# EAGLE design monBoard (EAGLE 5.12)

## Sheet 1 of 3
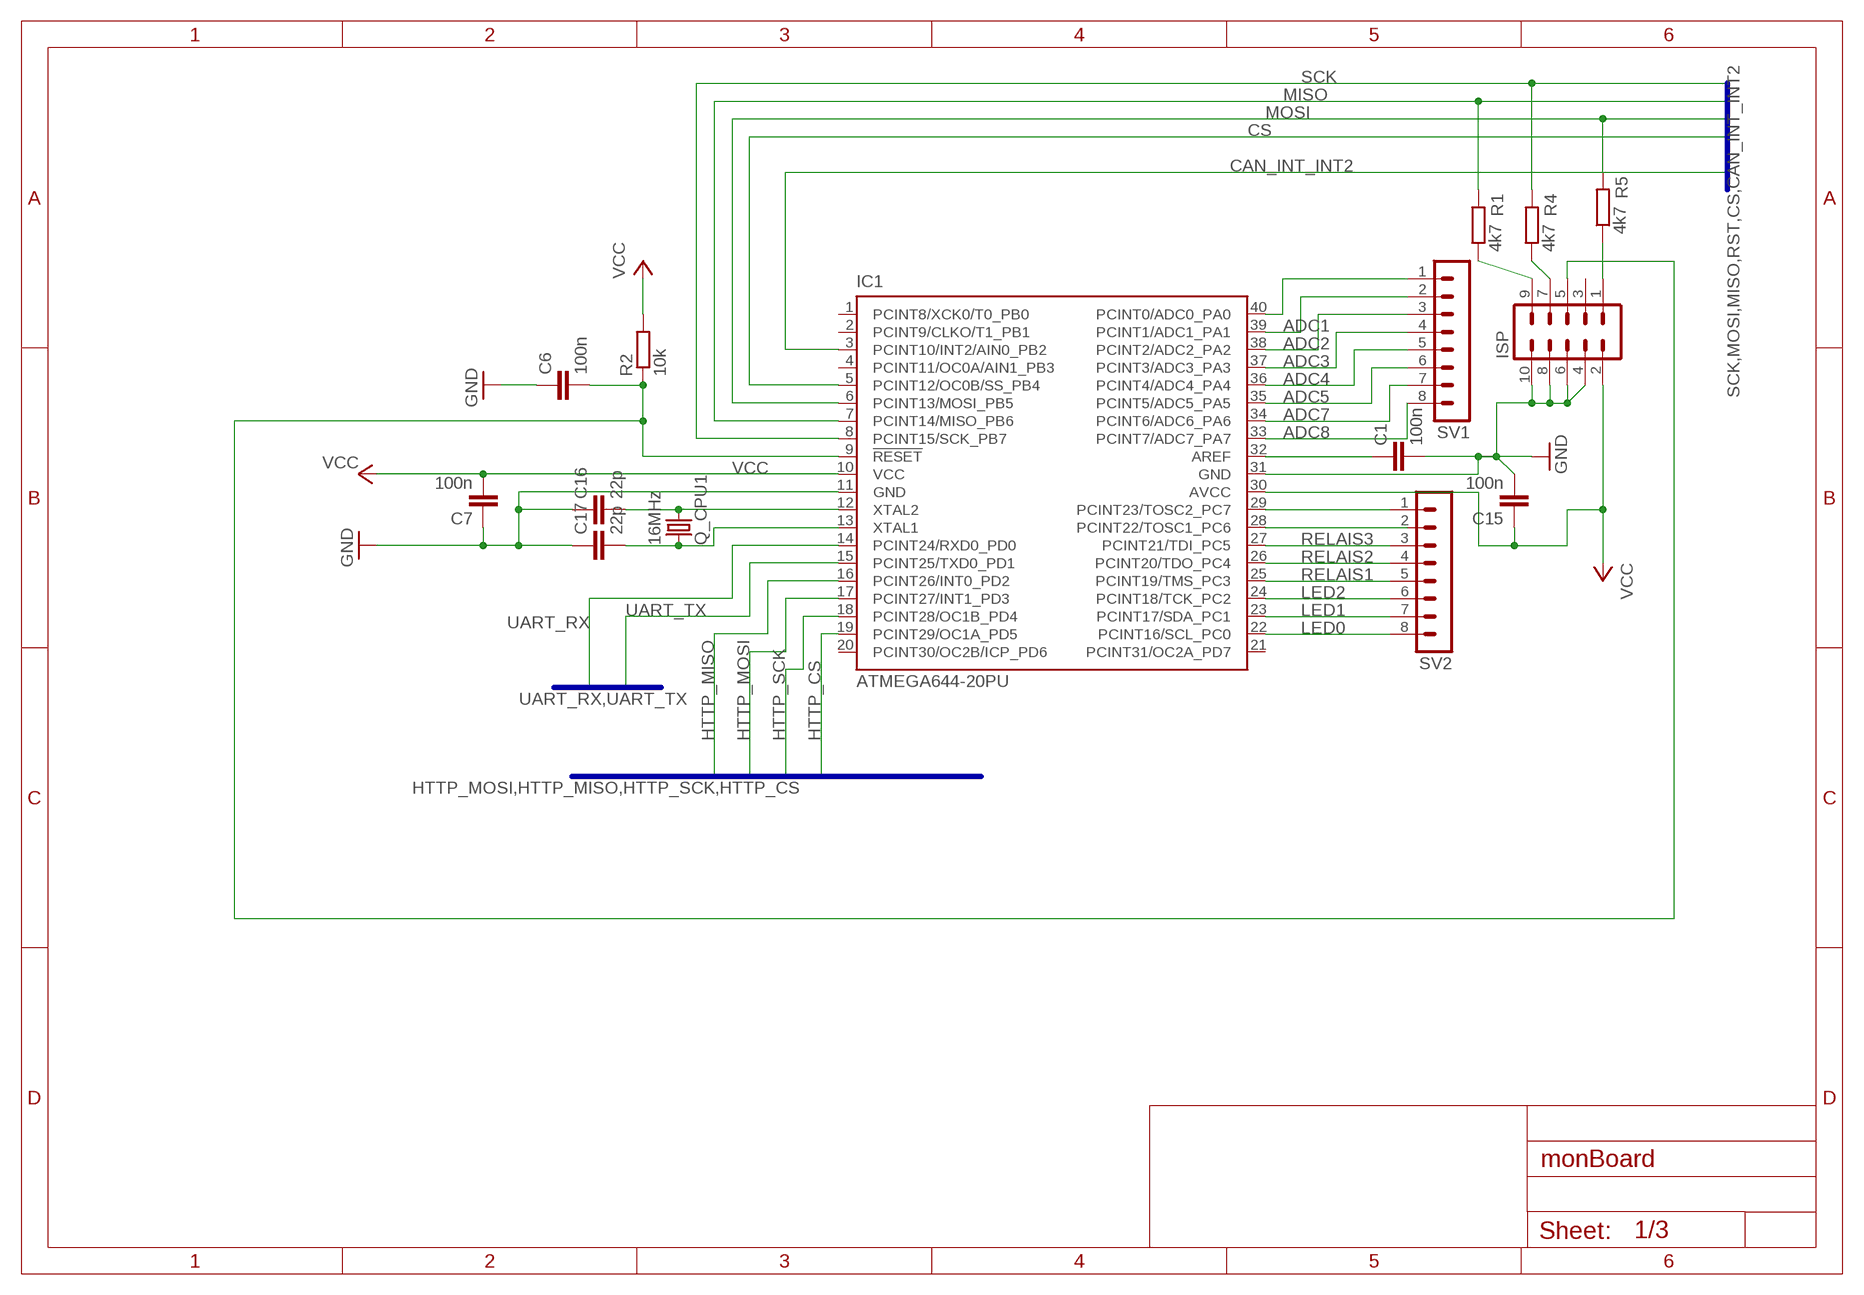
[diagram p0: schematic, sheet 1]

### Parts
C1  100n  C-EUC0603  [C0603]
C6  100n  C-EUC0603  [C0603]
C7  100n  C-EUC0603  [C0603]
C15  100n  C-EUC0603  [C0603]
C16  22p  C-EUC0603  [C0603]
C17  22p  C-EUC0603  [C0603]
IC1  ATMEGA644-20PU  [DIL40]
ISP  MA05-2  [MA05-2]
Q_CPU1  16MHz  CRYSTALHC49U-V  [HC49U-V]
R1  4k7  R-EU_R0805  [R0805]
R2  10k  R-EU_R0805  [R0805]
R4  4k7  R-EU_R0805  [R0805]
R5  4k7  R-EU_R0805  [R0805]
SV1  MA08-1  [MA08-1]
SV2  MA08-1  [MA08-1]

### Nets
ADC1: IC1.39(PCINT1/ADC1_PA1) SV1.2
ADC2: IC1.38(PCINT2/ADC2_PA2) SV1.3
ADC3: IC1.37(PCINT3/ADC3_PA3) SV1.4
ADC4: IC1.36(PCINT4/ADC4_PA4) SV1.5
ADC5: IC1.35(PCINT5/ADC5_PA5) SV1.6
ADC7: IC1.34(PCINT6/ADC6_PA6) SV1.7
ADC8: IC1.33(PCINT7/ADC7_PA7) SV1.8
CAN_INT_INT2: IC1.3(PCINT10/INT2/AIN0_PB2) ; also sheet 3
CS: IC1.5(PCINT12/OC0B/SS_PB4) ; also sheet 3
GND: C1.2 C6.1 C7.1 C15.2 C16.1 C17.1 IC1.11(GND) IC1.31(GND) ISP.4 ISP.6 ISP.8 ISP.10 ; also sheet 2,3
HTTP_CS: IC1.19(PCINT29/OC1A_PD5) ; also sheet 2
HTTP_MISO: IC1.16(PCINT26/INT0_PD2) ; also sheet 2
HTTP_MOSI: IC1.17(PCINT27/INT1_PD3) ; also sheet 2
HTTP_SCK: IC1.18(PCINT28/OC1B_PD4) ; also sheet 2
LED0: IC1.22(PCINT16/SCL_PC0) SV2.8
LED1: IC1.23(PCINT17/SDA_PC1) SV2.7
LED2: IC1.24(PCINT18/TCK_PC2) SV2.6
MISO: IC1.7(PCINT14/MISO_PB6) R1.2 ; also sheet 3
MOSI: IC1.6(PCINT13/MOSI_PB5) R5.2 ; also sheet 3
N$6: C16.2 IC1.12(XTAL2) Q_CPU1.1
N$7: C17.2 IC1.13(XTAL1) Q_CPU1.2
N$10: IC1.40(PCINT0/ADC0_PA0) SV1.1
N$14: IC1.28(PCINT22/TOSC1_PC6)
N$19: C1.1 IC1.32(AREF)
N$20: ISP.9 R1.1
N$25: ISP.1 R5.1
N$29: ISP.7 R4.1
N$33: C6.2 ISP.5 R2.1
N$34: IC1.29(PCINT23/TOSC2_PC7) SV2.1
RELAIS1: IC1.25(PCINT19/TMS_PC3) SV2.5
RELAIS2: IC1.26(PCINT20/TDO_PC4) SV2.4
RELAIS3: IC1.27(PCINT21/TDI_PC5) SV2.3
RESET: IC1.9(!RESET)
SCK: IC1.8(PCINT15/SCK_PB7) R4.2 ; also sheet 3
UART_RX: IC1.14(PCINT24/RXD0_PD0) ; also sheet 3
UART_TX: IC1.15(PCINT25/TXD0_PD1) ; also sheet 3
VCC: C7.2 C15.1 IC1.10(VCC) IC1.30(AVCC) ISP.2 R2.2 ; also sheet 3
Unconnected: IC1.1(PCINT8/XCK0/T0_PB0) IC1.2(PCINT9/CLKO/T1_PB1) IC1.4(PCINT11/OC0A/AIN1_PB3) IC1.20(PCINT30/OC2B/ICP_PD6) IC1.21(PCINT31/OC2A_PD7) ISP.3 SV2.2

### Buses
SCK,MOSI,MISO,RST,CS,CAN_INT_INT2
UART_RX,UART_TX
HTTP_MOSI,HTTP_MISO,HTTP_SCK,HTTP_CS

## Sheet 2 of 3
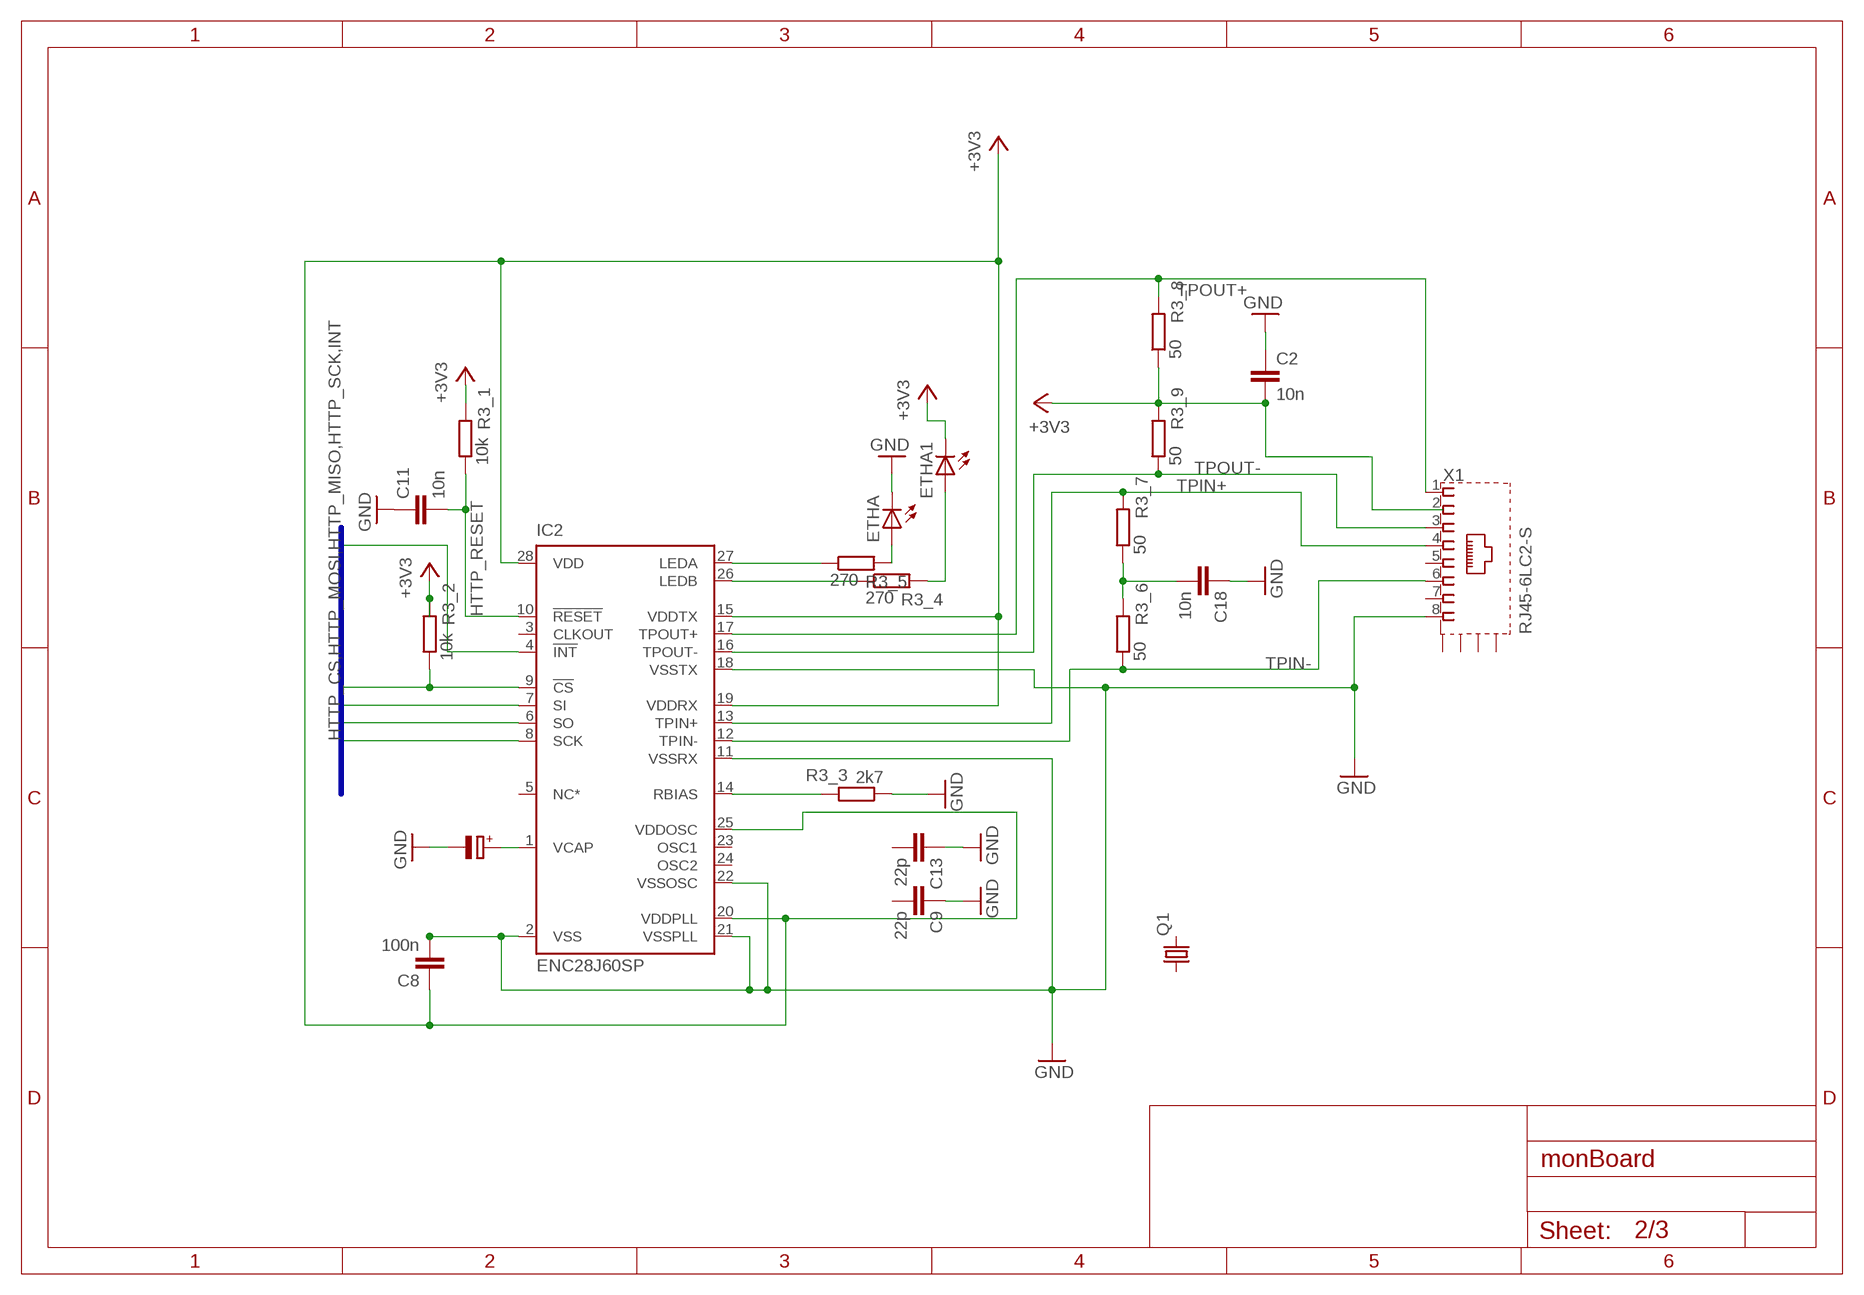
[diagram p1: schematic, sheet 2]

### Parts
C2  10n  C-EUC0603  [C0603]
C8  100n  C-EUC0603  [C0603]
C9  22p  C-EUC0603  [C0603]
C11  10n  C5/5  [C5B5]
C13  22p  C-EUC0603  [C0603]
C18  10n  C-EUC0603  [C0603]
ETHA  LEDCHIP-LED0805  [CHIP-LED0805]
ETHA1  LEDCHIP-LED0805  [CHIP-LED0805]
IC2  ENC28J60SP  [DIL28-3]
Q1  CRYSTALHC49U-V  [HC49U-V]
R3_1  10k  R-EU_R0805  [R0805]
R3_2  10k  R-EU_R0805  [R0805]
R3_3  2k7  R-EU_R0805  [R0805]
R3_4  270  R-EU_R0805  [R0805]
R3_5  270  R-EU_R0805  [R0805]
R3_6  50  R-EU_R0805  [R0805]
R3_7  50  R-EU_R0805  [R0805]
R3_8  50  R-EU_R0805  [R0805]
R3_9  50  R-EU_R0805  [R0805]
X1  RJ45-6LC2-S  [RJ45-SHIELD2]

### Nets
+3V3: C2.2 C8.1 ETHA1.C IC2.15(VDDTX) IC2.19(VDDRX) IC2.20(VDDPLL) IC2.25(VDDOSC) IC2.28(VDD) R3_1.2 R3_2.2 R3_8.1 R3_9.2 ; also sheet 3
GND: C2.1 C8.2 C9.1 C11.1 C13.1 C18.1 ETHA.C IC2.2(VSS) IC2.11(VSSRX) IC2.18(VSSTX) IC2.21(VSSPLL) IC2.22(VSSOSC) R3_3.1 X1.8 ; also sheet 1,3
HTTP_CS: IC2.9(!CS) R3_2.1 ; also sheet 1
HTTP_MISO: IC2.6(SO) ; also sheet 1
HTTP_MOSI: IC2.7(SI) ; also sheet 1
HTTP_RESET: C11.2 IC2.10(!RESET) R3_1.1
HTTP_SCK: IC2.8(SCK) ; also sheet 1
INT: IC2.4(!INT)
N$9: IC2.1(VCAP)
N$12: IC2.27(LEDA) R3_5.1
N$13: IC2.26(LEDB) R3_4.1
N$15: ETHA.A R3_5.2
N$16: ETHA1.A R3_4.2
N$24: C18.2 R3_6.2 R3_7.1
RBIAS: IC2.14(RBIAS) R3_3.2
TPIN+: IC2.13(TPIN+) R3_7.2 X1.4
TPIN-: IC2.12(TPIN-) R3_6.1 X1.6
TPOUT+: IC2.17(TPOUT+) R3_8.2 X1.1
TPOUT-: IC2.16(TPOUT-) R3_9.1 X1.3
Unconnected: C9.2 C13.2 IC2.3(CLKOUT) IC2.5(NC*) IC2.23(OSC1) IC2.24(OSC2) Q1.1 Q1.2 X1.2 X1.5 X1.7 X1.S1(S) X1.S2(S) X1.S3(S) X1.S4(S)

### Buses
HTTP_CS,HTTP_MOSI,HTTP_MISO,HTTP_SCK,INT

## Sheet 3 of 3
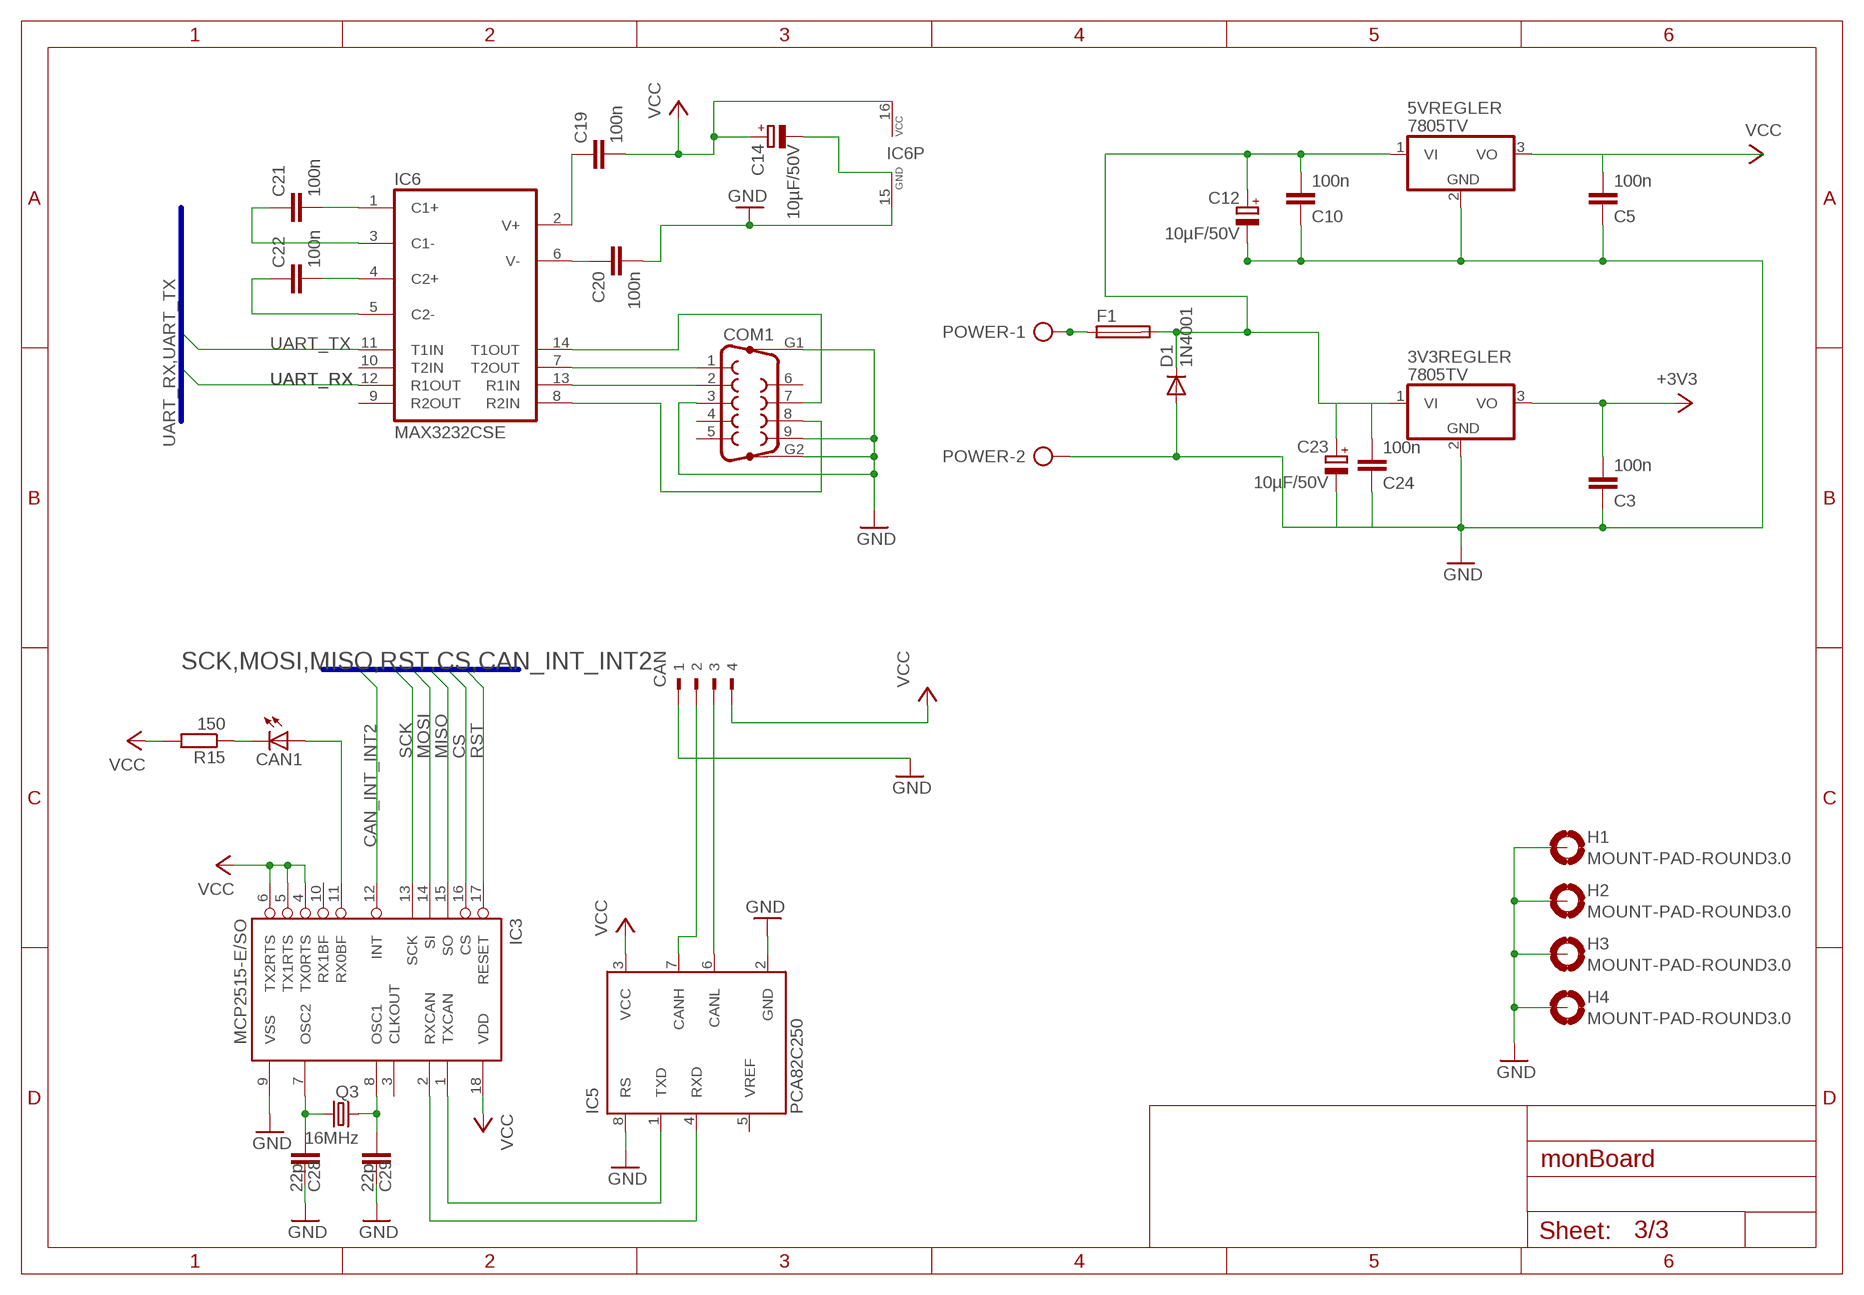
[diagram p2: schematic, sheet 3]

### Parts
3V3REGLER  7805TV  [TO220V]
5VREGLER  7805TV  [TO220V]
C3  100n  C-EUC0603  [C0603]
C5  100n  C-EUC0603  [C0603]
C10  100n  C-EUC0603  [C0603]
C12  10µF/50V  CPOL-EUE3.5-8  [E3,5-8]
C14  10µF/50V  CPOL-EUE3.5-8  [E3,5-8]
C19  100n  C-EUC0603  [C0603]
C20  100n  C-EUC0603  [C0603]
C21  100n  C-EUC0603  [C0603]
C22  100n  C-EUC0603  [C0603]
C23  10µF/50V  CPOL-EUE3.5-8  [E3,5-8]
C24  100n  C-EUC0603  [C0603]
C28  22p  C-EUC0603  [C0603]
C29  22p  C-EUC0603  [C0603]
CAN  90-4  [90-4]
CAN1  LEDCHIP-LED0805  [CHIP-LED0805]
COM1  F09HP  [F09HP]
D1  1N4001  1N4004  [DO41-10]
F1  SH22,5A  [SH22,5A]
H1  MOUNT-PAD-ROUND3.0  [3,0-PAD]
H2  MOUNT-PAD-ROUND3.0  [3,0-PAD]
H3  MOUNT-PAD-ROUND3.0  [3,0-PAD]
H4  MOUNT-PAD-ROUND3.0  [3,0-PAD]
IC3  MCP2515-E/SO  [SO18L]
IC5  PCA82C250  [DIL08]
IC6  MAX3232CSE  [SO16]
POWER  AK500/2-H  [AK500/2-H]
Q3  16MHz  CRYSTALHC49U-V  [HC49U-V]
R15  150  R-EU_R0805  [R0805]

### Nets
+3V3: 3V3REGLER.3(VO) C3.2 ; also sheet 2
CAN_INT_INT2: IC3.12(INT) ; also sheet 1
CS: IC3.16(CS) ; also sheet 1
GND: 3V3REGLER.2(GND) 5VREGLER.2(GND) C3.1 C5.1 C10.1 C12.- C20.2 C23.- C24.1 C28.2 C29.2 CAN.1 COM1.3 COM1.9 COM1.G1 COM1.G2 D1.A H1.B3,0(MOUNT) H2.B3,0(MOUNT) H3.B3,0(MOUNT) H4.B3,0(MOUNT) IC3.9(VSS) IC5.2(GND) IC5.8(RS) IC6.15(GND) POWER.2 ; also sheet 1,2
MISO: IC3.15(SO) ; also sheet 1
MOSI: IC3.14(SI) ; also sheet 1
N$1: C21.2 IC6.1(C1+)
N$3: IC3.1(TXCAN) IC5.1(TXD)
N$4: IC3.2(RXCAN) IC5.4(RXD)
N$5: CAN1.A IC3.11(RX0BF)
N$11: CAN.3 IC5.6(CANL)
N$30: C22.2 IC6.4(C2+)
N$32: C14.-
N$36: C22.1 IC6.5(C2-)
N$37: C21.1 IC6.3(C1-)
N$38 [Power]: F1.1 POWER.1
N$40: COM1.7 IC6.14(T1OUT)
N$41: COM1.8 IC6.8(R2IN)
N$42: 5VREGLER.3(VO) C5.2
N$43: C19.1 IC6.2(V+)
N$46: C20.1 IC6.6(V-)
N$48: CAN1.C R15.1
N$49: COM1.1 IC6.7(T2OUT)
N$50: COM1.2 IC6.13(R1IN)
N$53: C28.1 IC3.7(OSC2) Q3.1
N$54: C29.1 IC3.8(OSC1) Q3.2
N$56 [Power]: 3V3REGLER.1(VI) 5VREGLER.1(VI) C10.2 C12.+ C23.+ C24.2 D1.C F1.2
N$59: CAN.2 IC5.7(CANH)
RST: IC3.17(RESET)
SCK: IC3.13(SCK) ; also sheet 1
UART_RX: IC6.12(R1OUT) ; also sheet 1
UART_TX: IC6.11(T1IN) ; also sheet 1
VCC: C14.+ C19.2 CAN.4 IC3.4(TX0RTS) IC3.5(TX1RTS) IC3.6(TX2RTS) IC3.18(VDD) IC5.3(VCC) IC6.16(VCC) R15.2 ; also sheet 1
Unconnected: COM1.4 COM1.5 COM1.6 IC3.3(CLKOUT) IC3.10(RX1BF) IC5.5(VREF) IC6.9(R2OUT) IC6.10(T2IN)

### Buses
UART_RX,UART_TX
SCK,MOSI,MISO,RST,CS,CAN_INT_INT2

## Library data of the parts
3V3REGLER 5VREGLER = linear:78*: Positive VOLTAGE REGULATOR Source: http://cache.national.com/ds/LM/LM78L05.pdf http://www.fairchildsemi.com/ds/LM/LM7805.pdf
C1-C3 C5-C10 C13 C15-C22 C24 C28 C29 = rcl:C-EU: CAPACITOR, European symbol
C11 = capacitor-wima:C: CAPACITOR naming: grid - package width
C12 C14 C23 = rcl:CPOL-EU: POLARIZED CAPACITOR, European symbol
CAN = con-weidmueller-sl35:90-4: WEIDMUELLER CLAMP CONNECTOR; OC_FARNELL: unknown; OC_NEWARK: unknown
CAN1 ETHA ETHA1 = led:LED: LED OSRAM: - CHIPLED LG R971, LG N971, LY N971, LG Q971, LY Q971, LO R971, LY R971 LH N974, LH R974 LS Q976, LO Q976, LY Q976 LO Q996 - Hyper CHIPLED LW Q18S LB Q993, LB Q99A, LB R99A - SideLED LS A670, LO A670, LY A670, LG A670, LP A670 LB A673, LV A673, LT A673, LW A673 LH A674 LY A675 LS A676, LA A676, LO A676, LY A676, LW A676 LS A679, LY A679, LG A679 - Hyper Micro SIDELED® LS Y876, LA Y876, LO Y876, LY Y876 LT Y87S - SmartLED LW L88C, LW L88S LB L89C, LB L89S, LG L890 LS L89K, LO L89K, LY L89K LS L896, LA L896, LO L896, LY L896 - TOPLED LS T670, LO T670, LY T670, LG T670, LP T670 LSG T670, LSP T670, LSY T670, LOP T670, LYG T670 LG T671, LOG T671, LSG T671 LB T673, LV T673, LT T673, LW T673 LH T674 LS T676, LA T676, LO T676, LY T676, LB T676, LH T676, LSB T676, LW T676 LB T67C, LV T67C, LT T67C, LS T67K, LO T67K, LY T67K, LW E67C LS E67B, LA E67B, LO E67B, LY E67B, LB E67C, LV E67C, LT E67C LW T67C LS T679, LY T679, LG T679 LS T770, LO T770, LY T770, LG T770, LP T770 LB T773, LV T773, LT T773, LW T773 LH T774 LS E675, LA E675, LY E675, LS T675 LS T776, LA T776, LO T776, LY T776, LB T776 LHGB T686 LT T68C, LB T68C - Hyper Mini TOPLED® LB M676 - Mini TOPLED Santana® LG M470 LS M47K, LO M47K, LY M47K Source: http://www.osram.convergy.de LUXEON: - LUMILED® LXK2-PW12-R00, LXK2-PW12-S00, LXK2-PW14-U00, LXK2-PW14-V00 LXK2-PM12-R00, LXK2-PM12-S00, LXK2-PM14-U00 LXK2-PE12-Q00, LXK2-PE12-R00, LXK2-PE12-S00, LXK2-PE14-T00, LXK2-PE14-U00 LXK2-PB12-K00, LXK2-PB12-L00, LXK2-PB12-M00, LXK2-PB14-N00, LXK2-PB14-P00, LXK2-PB14-Q00 LXK2-PR12-L00, LXK2-PR12-M00, LXK2-PR14-Q00, LXK2-PR14-R00 LXK2-PD12-Q00, LXK2-PD12-R00, LXK2-PD12-S00 LXK2-PH12-R00, LXK2-PH12-S00 LXK2-PL12-P00, LXK2-PL12-Q00, LXK2-PL12-R00 Source: www.luxeon.com KINGBRIGHT: KA-3528ASYC Source: www.kingbright.com
COM1 = con-subd:F09HP: SUB-D; OC_FARNELL: unknown; OC_NEWARK: unknown
D1 = diode:1N4004: DIODE general purpose rectifier, 1 A
F1 = fuse:SH22,5A: FUSE HOLDER grid 22,5mm, isolated cap OGN0031 8201, Schurter (Buerklin)
H1-H4 = holes:MOUNT-PAD-ROUND: MOUNTING PAD, round
IC1 = atmel:ATMEGA644-*PU: 8-bit Microcontroller with 64K Bytes In-System Programmable Flash Auto generated by make-symbol-device-package-bsdl.ulp Rev. 34 Source: http://www.atmel.com/dyn/resources/prod_documents/doc2593.pdf; MPN: ATMEGA644-20PU; OC_FARNELL: 1288340; OC_NEWARK: 23M5060
IC2 = microchip:ENC28J60: Stand-Alone Ethernet Controller with SPI Interface Source: http://ww1.microchip.com/downloads/en/DeviceDoc/39662c.pdf; MF: MICROCHIP; MPN: ENC28J60/SP; OC_FARNELL: 1084619; OC_NEWARK: 96K3661
IC3 = mcp2515:MCP2515
IC5 = micro-philips:PCA82C250: CAN CONTROLLER INTERFACE; OC_FARNELL: 3692358; OC_NEWARK: unknown
IC6 = maxim:MAX3232*: True RS-232 Transceivers 3.0V to 5.5V, Low-Power up to 1Mbps, Using Four 0.1µF External Capacitors Source: http://pdfserv.maxim-ic.com/en/ds/MAX3222-MAX3241.pdf; MPN: MAX3232CSE; OC_FARNELL: 9725490; OC_NEWARK: 90C2890
ISP = con-lstb:MA05-2: PIN HEADER; OC_FARNELL: unknown; OC_NEWARK: unknown
POWER = con-ptr500:AK500/2-H: CONNECTOR Aug. 2004 / PTR Meßtechnik: Die Bezeichnung der Serie AK505 wurde geändert. Es handelt sich hierbei um AK500 in horizontaler Ausführung.
Q1 Q3 Q_CPU1 = crystal:CRYSTAL: CRYSTAL; OC_FARNELL: 1666969; OC_NEWARK: unknown
R1 R2 R3_1-R3_9 R4 R5 R15 = rcl:R-EU_: RESISTOR, European symbol
SV1 SV2 = con-lstb:MA08-1: PIN HEADER; OC_FARNELL: unknown; OC_NEWARK: unknown
X1 = con-tycoelectronics:RJ45*2: RJ45 Low Profile Shield Type 2 For all RJ45 L, LC, LCT and X Series Models Source: www.tycoelectronics.com .. ENG_DS_1654001_1099_RJ_L_0507.pdf; MPN: RJ45-6LC2-S; OC_FARNELL: unknown; OC_NEWARK: 16R6095

## Net classes
1 Power: width 0.406 mm

## Board
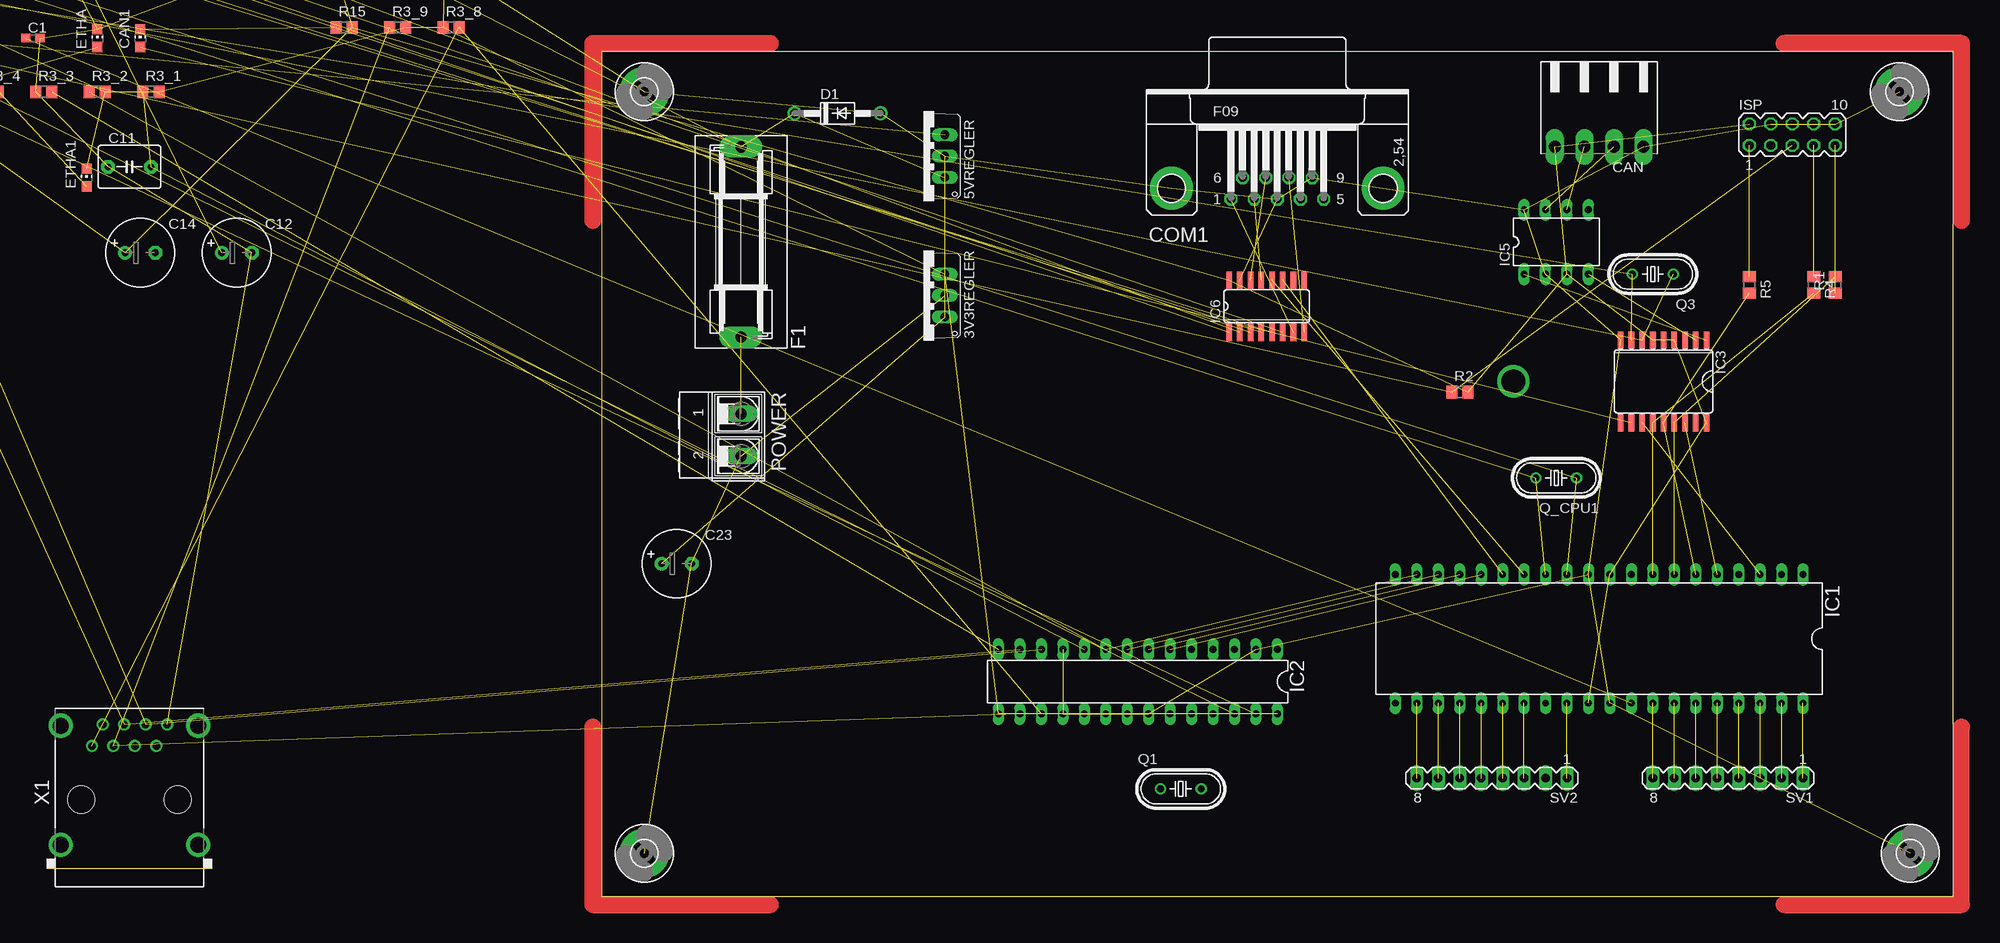
[diagram p3: board, top side]
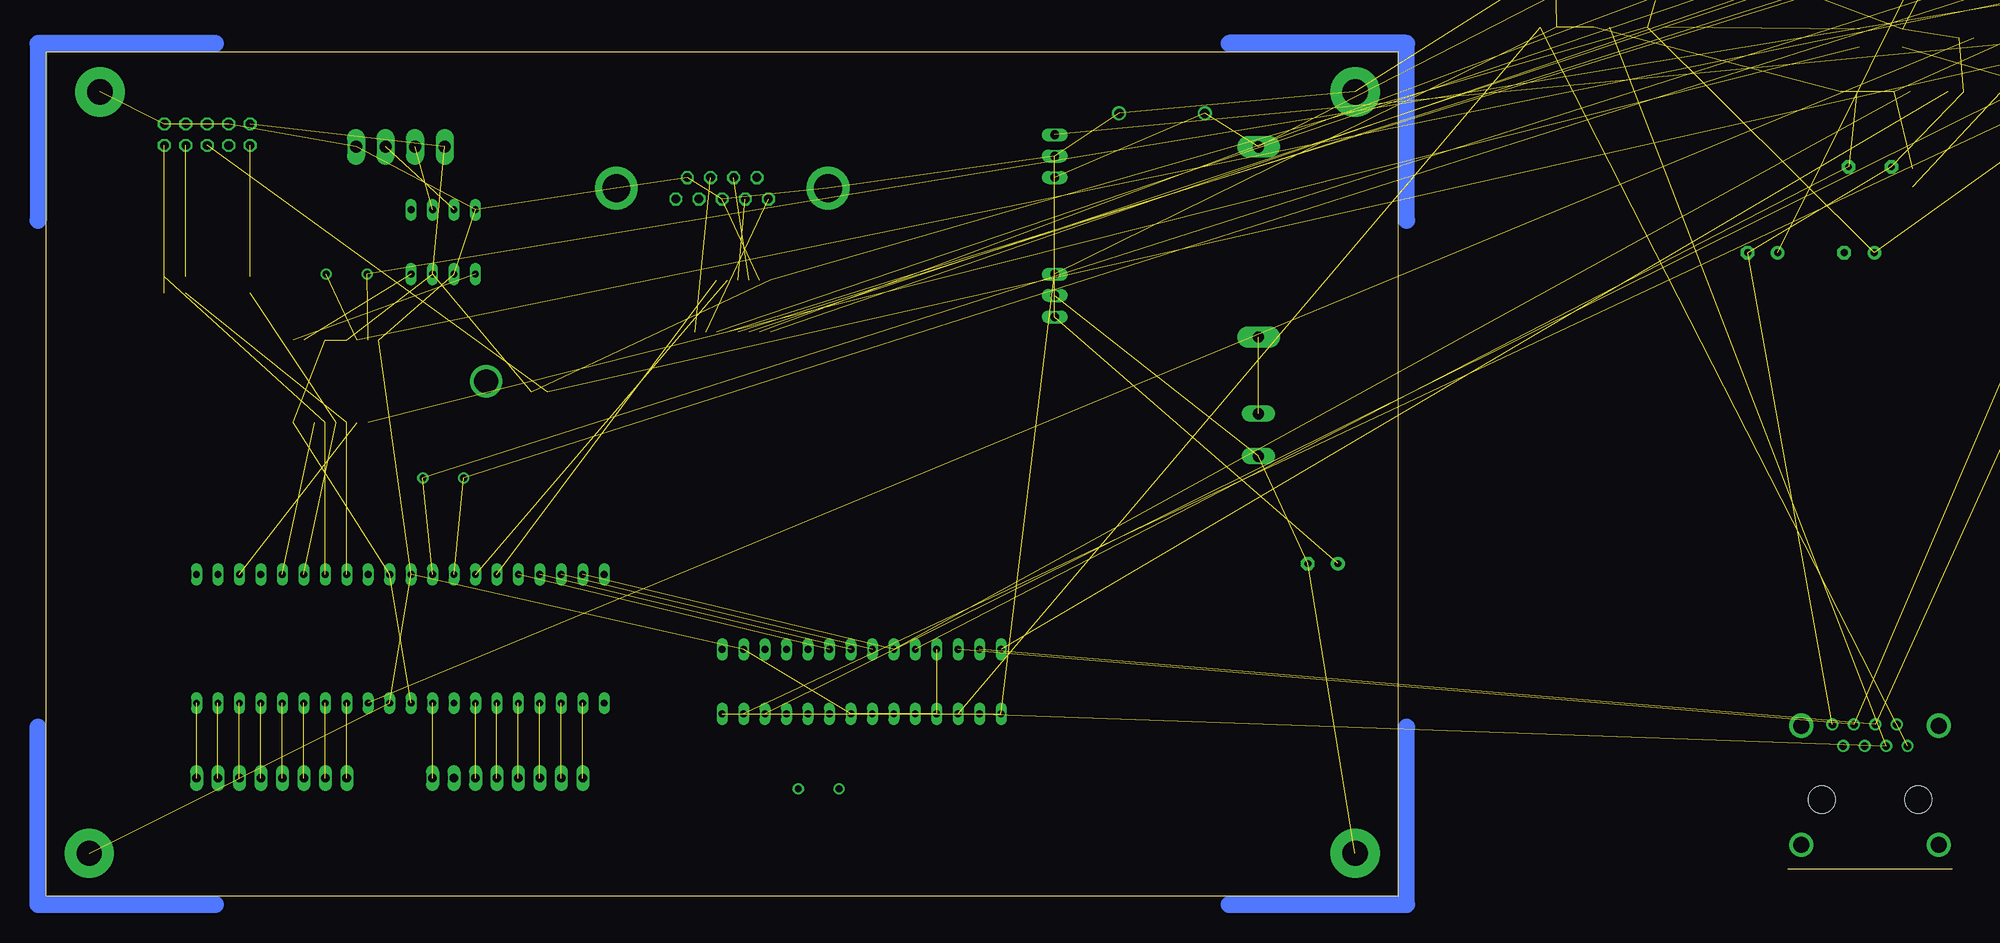
[diagram p4: board, bottom side, seen from below]

Size 160 x 100 mm. Coordinates in mm from the lower left corner, seen from the top.
Outline: 0,0 160,0 160,100 0,100 0,0
Copper layers (1*16): Top 0.035mm / dielectric 1.5mm / Bottom 0.035mm
Design rules "default": minimum track width 10mil, minimum drill 24mil, track to track 8mil, track to pad 8mil, pad to pad 8mil, via to via 8mil, smd to smd 8mil, copper to edge 40mil, drill to drill 8mil, minimum pad ring 10mil, minimum via ring 8mil, stop-mask expansion 4mil, vias tented up to drill 0mil, thermal gap 10mil

### Footprints (pad centres in the part's own frame; a part is rotated, then mirrored left to right if it is on the bottom)
TO220V = drill 1.016 long: 1 -2.54,-2.54; 2 0,-2.54; 3 2.54,-2.54
C0603 = smd 1.1 x 1: 1 -0.85,0; 2 0.85,0
C5B5 = drill 0.813 pad 1.6 octagon: 1 -2.54,0; 2 2.54,0
E3,5-8 = drill 0.813 pad 1.6 round: + -1.778,0 | drill 0.813 pad 1.6 octagon: - 1.778,0
90-4 = drill 1.422 long: 1 -5.25,5.25; 2 -1.75,5.25; 3 1.75,5.25; 4 5.25,5.25
CHIP-LED0805 = smd 1.2 x 1.2: A 0,-1.05; C 0,1.05
F09HP = drill 1.016 octagon: 1 -5.486,-1.27; 2 -2.743,-1.27; 3 0,-1.27; 4 2.743,-1.27; 5 5.486,-1.27; 6 -4.115,1.27; 7 -1.372,1.27; 8 1.372,1.27; 9 4.115,1.27 | drill 3.302 pad 5.08 round: G1 -12.522,0; G2 12.522,0
DO41-10 = drill 1.118 round: A 5.08,0; C -5.08,0
SH22,5A = drill 1.321 pad 2.54 long: 1 -11.252,0; 2 11.252,0
3,0-PAD = drill 3 pad 5.842 round: B3,0 0,0
DIL40 = drill 0.813 long: 1 -24.13,-7.62; 2 -21.59,-7.62; 3 -19.05,-7.62; 4 -16.51,-7.62; 5 -13.97,-7.62; 6 -11.43,-7.62; 7 -8.89,-7.62; 8 -6.35,-7.62; 9 -3.81,-7.62; 10 -1.27,-7.62; 11 1.27,-7.62; 12 3.81,-7.62; 13 6.35,-7.62; 14 8.89,-7.62; 15 11.43,-7.62; 16 13.97,-7.62; 17 16.51,-7.62; 18 19.05,-7.62; 19 21.59,-7.62; 20 24.13,-7.62; 21 24.13,7.62; 22 21.59,7.62; 23 19.05,7.62; 24 16.51,7.62; 25 13.97,7.62; 26 11.43,7.62; 27 8.89,7.62; 28 6.35,7.62; 29 3.81,7.62; 30 1.27,7.62; 31 -1.27,7.62; 32 -3.81,7.62; 33 -6.35,7.62; 34 -8.89,7.62; 35 -11.43,7.62; 36 -13.97,7.62; 37 -16.51,7.62; 38 -19.05,7.62; 39 -21.59,7.62; 40 -24.13,7.62
DIL28-3 = drill 0.813 long: 1 -16.51,-3.81; 2 -13.97,-3.81; 3 -11.43,-3.81; 4 -8.89,-3.81; 5 -6.35,-3.81; 6 -3.81,-3.81; 7 -1.27,-3.81; 8 1.27,-3.81; 9 3.81,-3.81; 10 6.35,-3.81; 11 8.89,-3.81; 12 11.43,-3.81; 13 13.97,-3.81; 14 16.51,-3.81; 15 16.51,3.81; 16 13.97,3.81; 17 11.43,3.81; 18 8.89,3.81; 19 6.35,3.81; 20 3.81,3.81; 21 1.27,3.81; 22 -1.27,3.81; 23 -3.81,3.81; 24 -6.35,3.81; 25 -8.89,3.81; 26 -11.43,3.81; 27 -13.97,3.81; 28 -16.51,3.81
SO18L = smd 0.66 x 2.032: 1 -5.08,-4.902; 2 -3.81,-4.902; 3 -2.54,-4.902; 4 -1.27,-4.902; 5 0,-4.902; 6 1.27,-4.902; 7 2.54,-4.902; 8 3.81,-4.902; 9 5.08,-4.902; 10 5.08,4.902; 11 3.81,4.902; 12 2.54,4.902; 13 1.27,4.902; 14 0,4.902; 15 -1.27,4.902; 16 -2.54,4.902; 17 -3.81,4.902; 18 -5.08,4.902
DIL08 = drill 0.813 long: 1 -3.81,-3.81; 2 -1.27,-3.81; 3 1.27,-3.81; 4 3.81,-3.81; 5 3.81,3.81; 6 1.27,3.81; 7 -1.27,3.81; 8 -3.81,3.81
SO16 = smd 0.66 x 2.032: 1 -4.445,-3.073; 2 -3.175,-3.073; 3 -1.905,-3.073; 4 -0.635,-3.073; 5 0.635,-3.073; 6 1.905,-3.073; 7 3.175,-3.073; 8 4.445,-3.073; 9 4.445,3.073; 10 3.175,3.073; 11 1.905,3.073; 12 0.635,3.073; 13 -0.635,3.073; 14 -1.905,3.073; 15 -3.175,3.073; 16 -4.445,3.073
MA05-2 = drill 1.016 octagon: 1 -5.08,-1.27; 2 -5.08,1.27; 3 -2.54,-1.27; 4 -2.54,1.27; 5 0,-1.27; 6 0,1.27; 7 2.54,-1.27; 8 2.54,1.27; 9 5.08,-1.27; 10 5.08,1.27
AK500/2-H = drill 1.321 long: 1 -2.515,0; 2 2.515,0
HC49U-V = drill 0.813 round: 1 -2.413,0; 2 2.413,0
R0805 = smd 1.3 x 1.5: 1 -0.95,0; 2 0.95,0
MA08-1 = drill 1.016 long: 1 -8.89,0; 2 -6.35,0; 3 -3.81,0; 4 -1.27,0; 5 1.27,0; 6 3.81,0; 7 6.35,0; 8 8.89,0
RJ45-SHIELD2 = drill 0.9 pad 1.4 round: 1 -4.445,6.35; 2 -3.175,8.89; 3 -1.905,6.35; 4 -0.635,8.89; 5 0.635,6.35; 6 1.905,8.89; 7 3.175,6.35; 8 4.445,8.89 | drill 1.9 pad 2.5 round: S1 -8.128,-5.33; S2 8.128,-5.33; S3 -8.128,8.76; S4 8.128,8.76 | hole 3.251: -5.715,0; 5.715,0

### Placement (x,y rotation side)
3V3REGLER  38.1,71.12 90 top
5VREGLER  38.1,87.63 90 top
C1  -67.31,101.6 0 top  (outside the outline)
C2  -16.51,114.3 0 top  (outside the outline)
C3  -73.66,101.6 0 top  (outside the outline)
C5  -80.01,101.6 0 top  (outside the outline)
C6  -86.36,101.6 0 top  (outside the outline)
C7  -92.71,101.6 0 top  (outside the outline)
C8  -17.78,109.22 0 top  (outside the outline)
C9  -21.59,114.3 0 top  (outside the outline)
C10  -24.13,109.22 0 top  (outside the outline)
C11  -55.88,86.36 0 top  (outside the outline)
C12  -43.18,76.2 0 top  (outside the outline)
C13  -67.31,109.22 0 top  (outside the outline)
C14  -54.61,76.2 0 top  (outside the outline)
C15  -30.48,109.22 0 top  (outside the outline)
C16  -72.39,109.22 0 top  (outside the outline)
C17  -77.47,109.22 0 top  (outside the outline)
C18  -82.55,109.22 0 top  (outside the outline)
C19  -36.83,109.22 0 top  (outside the outline)
C20  -43.18,109.22 0 top  (outside the outline)
C21  -49.53,109.22 0 top  (outside the outline)
C22  -55.88,109.22 0 top  (outside the outline)
C23  8.89,39.37 0 top
C24  -62.23,109.22 0 top  (outside the outline)
C28  -87.63,109.22 0 top  (outside the outline)
C29  -92.71,109.22 0 top  (outside the outline)
CAN  118.11,93.98 180 top
CAN1  -54.61,101.6 0 top  (outside the outline)
COM1  80.01,83.82 0 top
D1  27.94,92.71 0 top
ETHA  -59.69,101.6 0 top  (outside the outline)
ETHA1  -60.96,85.09 0 top  (outside the outline)
F1  16.51,77.47 90 top
H1  154.94,5.08 0 top
H2  5.08,95.25 0 top
H3  5.08,5.08 0 top
H4  153.67,95.25 0 top
IC1  118.11,30.48 180 top
IC2  63.5,25.4 180 top
IC3  125.73,60.96 180 top
IC5  113.03,77.47 0 top
IC6  78.74,69.85 0 top
ISP  140.97,90.17 0 top
POWER  16.51,54.61 270 top
Q1  68.58,12.7 0 top
Q3  124.46,73.66 180 top
Q_CPU1  113.03,49.53 180 top
R1  146.05,72.39 90 top
R2  101.6,59.69 0 top
R3_1  -53.34,95.25 0 top  (outside the outline)
R3_2  -59.69,95.25 0 top  (outside the outline)
R3_3  -66.04,95.25 0 top  (outside the outline)
R3_4  -72.39,95.25 0 top  (outside the outline)
R3_5  -78.74,95.25 0 top  (outside the outline)
R3_6  -85.09,95.25 0 top  (outside the outline)
R3_7  -91.44,95.25 0 top  (outside the outline)
R3_8  -17.78,102.87 0 top  (outside the outline)
R3_9  -24.13,102.87 0 top  (outside the outline)
R4  143.51,72.39 270 top
R5  135.89,72.39 270 top
R15  -30.48,102.87 0 top  (outside the outline)
SV1  133.35,13.97 180 top
SV2  105.41,13.97 180 top
X1  -55.88,11.43 0 top  (outside the outline)

### Tracks (layer width: path | path; a pad name or v marks a point on that pad's centre or on a via)
+3V3  (13 unrouted)
ADC1  (1 unrouted)
ADC2  (1 unrouted)
ADC3  (1 unrouted)
ADC4  (1 unrouted)
ADC5  (1 unrouted)
ADC7  (1 unrouted)
ADC8  (1 unrouted)
CAN_INT_INT2  (1 unrouted)
CS  (1 unrouted)
GND  (51 unrouted)
HTTP_CS  (2 unrouted)
HTTP_MISO  (1 unrouted)
HTTP_MOSI  (1 unrouted)
HTTP_RESET  (2 unrouted)
HTTP_SCK  (1 unrouted)
LED0  (1 unrouted)
LED1  (1 unrouted)
LED2  (1 unrouted)
MISO  (2 unrouted)
MOSI  (2 unrouted)
N$1  (1 unrouted)
N$2
  Top 2: 20,-1 -1,-1 -1,20
N$3  (1 unrouted)
N$4  (1 unrouted)
N$5  (1 unrouted)
N$6  (2 unrouted)
N$7  (2 unrouted)
N$8
  Top 2: 140,-1 161,-1 161,20
N$10  (1 unrouted)
N$11  (1 unrouted)
N$12  (1 unrouted)
N$13  (1 unrouted)
N$15  (1 unrouted)
N$16  (1 unrouted)
N$17
  Top 2: 20,101 -1,101 -1,80
N$18
  Top 2: 161,80 161,101 140,101
N$19  (1 unrouted)
N$20  (1 unrouted)
N$21
  Bottom 2: 20,-1 -1,-1 -1,20
N$22
  Bottom 2: 140,-1 161,-1 161,20
N$23
  Bottom 2: 20,101 -1,101 -1,80
N$24  (2 unrouted)
N$25  (1 unrouted)
N$26
  Bottom 2: 161,80 161,101 140,101
N$29  (1 unrouted)
N$30  (1 unrouted)
N$33  (2 unrouted)
N$34  (1 unrouted)
N$35  (via drill 2.8 pad 3.81)
  other vias: 107.95,60.96
N$36  (1 unrouted)
N$37  (1 unrouted)
N$38  (1 unrouted)
N$40  (1 unrouted)
N$41  (1 unrouted)
N$42  (1 unrouted)
N$43  (1 unrouted)
N$46  (1 unrouted)
N$48  (1 unrouted)
N$49  (1 unrouted)
N$50  (1 unrouted)
N$53  (2 unrouted)
N$54  (2 unrouted)
N$56  (7 unrouted)
N$59  (1 unrouted)
RBIAS  (1 unrouted)
RELAIS1  (1 unrouted)
RELAIS2  (1 unrouted)
RELAIS3  (1 unrouted)
SCK  (2 unrouted)
TPIN+  (2 unrouted)
TPIN-  (2 unrouted)
TPOUT+  (2 unrouted)
TPOUT-  (2 unrouted)
UART_RX  (1 unrouted)
UART_TX  (1 unrouted)
VCC  (15 unrouted)